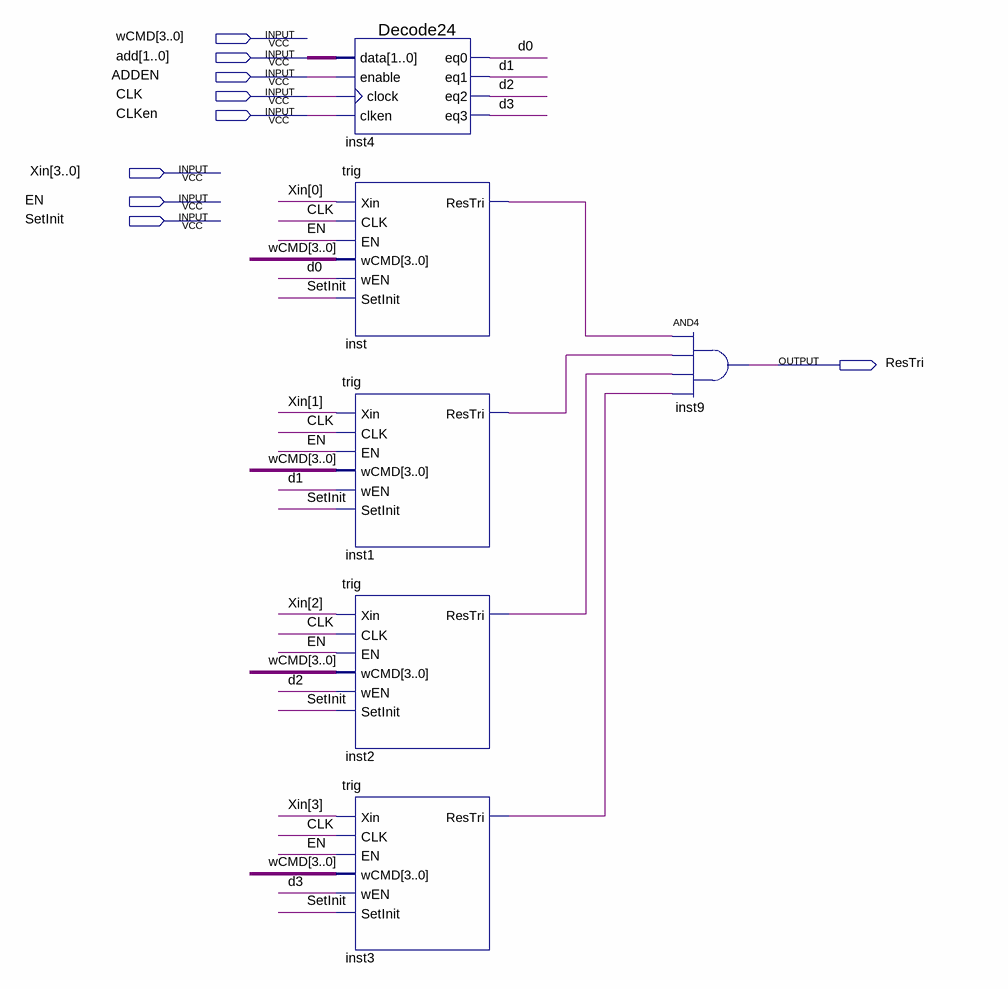
[diagram p0: schematic sheet]
// Quartus schematic QTrig.bdf as structural Verilog: 6 symbols, 9 pins
module QTrig (
  input  [3:0] wCMD,
  input  [1:0] add,
  input  ADDEN,
  input  CLK,
  input  CLKen,
  input  [3:0] Xin,
  input  EN,
  input  SetInit,
  output ResTri
);

  wire d0, d1, d2, d3, inst1_restri, inst2_restri, inst3_restri, inst_restri;

  Decode24 inst4 (.data(add), .enable(ADDEN), .clock(CLK), .clken(CLKen), .eq0(d0), .eq1(d1), .eq2(d2), .eq3(d3));
  trig inst (.Xin(Xin[0]), .CLK(CLK), .EN(EN), .wCMD(wCMD), .wEN(d0), .SetInit(SetInit), .ResTri(inst_restri));
  trig inst1 (.Xin(Xin[1]), .CLK(CLK), .EN(EN), .wCMD(wCMD), .wEN(d1), .SetInit(SetInit), .ResTri(inst1_restri));
  trig inst2 (.Xin(Xin[2]), .CLK(CLK), .EN(EN), .wCMD(wCMD), .wEN(d2), .SetInit(SetInit), .ResTri(inst2_restri));
  trig inst3 (.Xin(Xin[3]), .CLK(CLK), .EN(EN), .wCMD(wCMD), .wEN(d3), .SetInit(SetInit), .ResTri(inst3_restri));
  and inst9 (ResTri, inst_restri, inst1_restri, inst2_restri, inst3_restri);
endmodule
